# Altium schematic sheet AMU-S21-V00-CURRENT5kWDetection.SchDoc: 5kW Detection / Comparison
size A3; DrawnBy: Jonn Dillon; DocumentNumber: 7; SheetNumber: 19; SheetTotal: 25; Project: Shutdown Current Board 2020
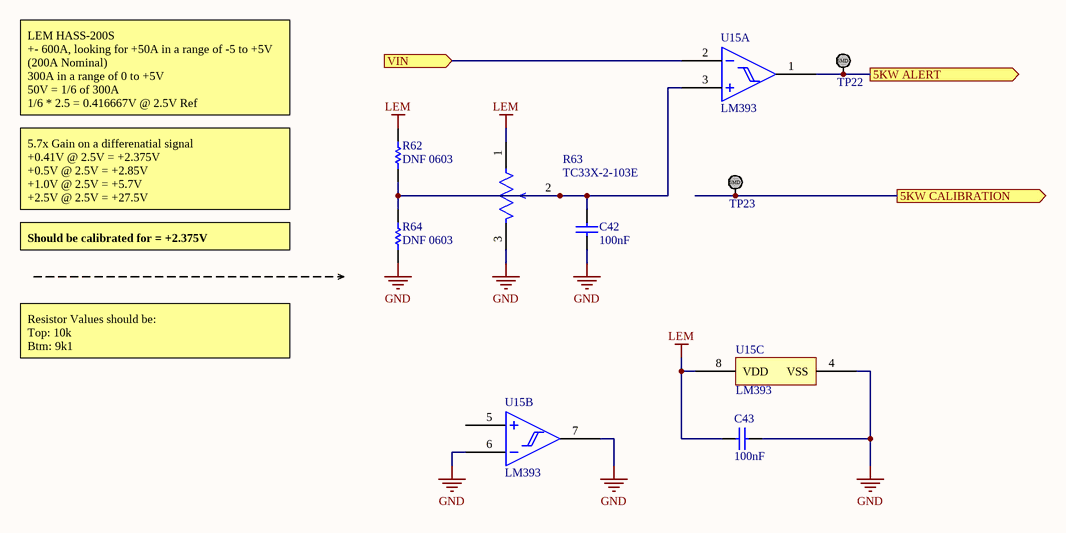
[diagram p0: AMU-S21-V00-CURRENT5kWDetection.SchDoc]

## Parts
C42  100nF  [Cap_Ceramic_0603]
C43  100nF  [Cap_Ceramic_0603]
R62  DNF 0603  [Res_ThinFilm_0603]
R63  TC33X-2-103E  [TC33]
R64  DNF 0603  [Res_ThinFilm_0603]
TP22  TestPoint_SMD  [TestPointSMD]  (value not drawn)
TP23  TestPoint_SMD  [TestPointSMD]  (value not drawn)
U15  LM393  [TSSOP-8]  (parts A,B,C of 3)

## Ports
5KW ALERT (out), 5KW CALIBRATION (out), VIN (in)

## Nets
GND: C42.1 C43.2 R63.3 R64.1 U15.4(VSS) U15.6(IN2-) U15.7(OUT1)
LEM: C43.1 R62.2 R63.1 U15.8(VDD)
5KW ALERT: TP22.1 U15.1(OUT1) ; port 5KW ALERT
5KW CALIBRATION: TP23.1 ; port 5KW CALIBRATION
VIN: U15.2(IN1-) ; port VIN
NetC42_2: C42.2 R62.1 R63.2 R64.2 U15.3(IN1+)

Not connected (* = marked no-connect by the designer): U15 5(IN2+)

## Notes on the sheet
- LEM HASS-200S
  +- 600A, looking for +50A in a range of -5 to +5V
  (200A Nominal)
  300A in a range of 0 to +5V
  50V = 1/6 of 300A
  1/6 * 2.5 = 0.416667V @ 2.5V Ref
- 5.7x Gain on a differenatial signal
  +0.41V @ 2.5V = +2.375V
  +0.5V @ 2.5V = +2.85V
  +1.0V @ 2.5V = +5.7V
  +2.5V @ 2.5V = +27.5V
- Should be calibrated for = +2.375V
- Resistor Values should be:
  Top: 10k
  Btm: 9k1
- Revision History:
- Sheet Title:
- Rev
- Date
- Description
- Project:
- Size:
- Drawn By:
- A3
- Number:
- Revision:
- Sheet
- Version:
- of
- QUT Motorsport
- O-120, Gardens Point
- 2 George Street
- Brisbane, QLD 4000
- Australia
- Print Date:
- Print Time:
- File Name:
- (in symbol TestPoint_SMD) SMD

## Library data of the parts
C42 C43 = 100nF 50V 5% X7R 0603: Capacitor, Ceramic, SMD, 100nF, 50V, 5%, X7R, 0603
R62 R64 = DNF 0603: Resistor, SMD, DNF, 0.1W, 0603
R63 = TC33X-2-103E: 10 kOhms 0.1W, 1/10W J Lead Surface Mount Trimmer Potentiometer Cermet 1 Turn Top Adjustment
U15 = LM393: General Purpose Comparitor 2 Circuit 8-SOIC